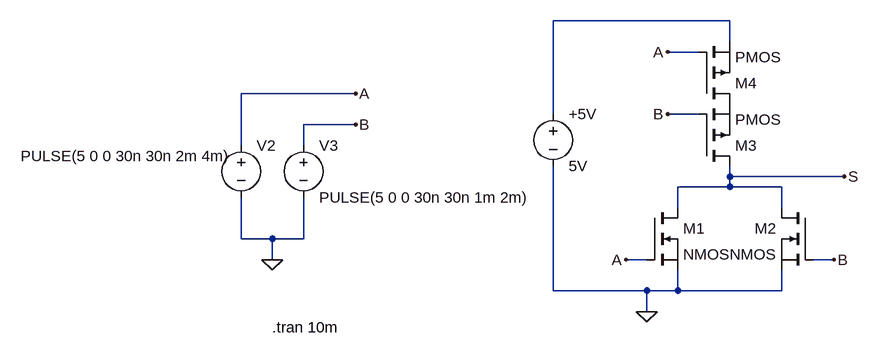
[diagram p0: schematic NOR.asc]
NOR.asc, the LTspice schematic file:
Version 4
SHEET 1 880 680
WIRE 352 48 80 48
WIRE 352 80 352 48
WIRE 304 96 256 96
WIRE -224 160 -400 160
WIRE 80 192 80 48
WIRE 304 192 256 192
WIRE -224 208 -304 208
WIRE -400 240 -400 160
WIRE -304 240 -304 208
WIRE 352 288 352 272
WIRE 528 288 352 288
WIRE 352 304 352 288
WIRE 352 304 272 304
WIRE 432 304 352 304
WIRE 272 336 272 304
WIRE 432 336 432 304
WIRE -400 384 -400 320
WIRE -352 384 -400 384
WIRE -304 384 -304 320
WIRE -304 384 -352 384
WIRE -352 416 -352 384
WIRE 224 416 192 416
WIRE 512 416 480 416
WIRE 80 464 80 272
WIRE 224 464 80 464
WIRE 272 464 272 432
WIRE 272 464 224 464
WIRE 432 464 432 432
WIRE 432 464 272 464
WIRE 224 496 224 464
FLAG -352 416 0
FLAG -224 160 A
FLAG -224 208 B
FLAG 256 96 A
FLAG 256 192 B
FLAG 224 496 0
FLAG 192 416 A
FLAG 512 416 B
FLAG 528 288 S
SYMBOL voltage 80 176 R0
WINDOW 123 0 0 Left 0
WINDOW 39 0 0 Left 0
SYMATTR InstName +5V
SYMATTR Value 5V
SYMBOL voltage -400 224 R0
WINDOW 3 -339 32 Left 2
WINDOW 123 0 0 Left 0
WINDOW 39 0 0 Left 0
SYMATTR Value PULSE(5 0 0 30n 30n 2m 4m)
SYMATTR InstName V2
SYMBOL voltage -304 224 R0
WINDOW 123 0 0 Left 0
WINDOW 39 0 0 Left 0
SYMATTR InstName V3
SYMATTR Value PULSE(5 0 0 30n 30n 1m 2m)
SYMBOL nmos 224 336 R0
SYMATTR InstName M1
SYMBOL nmos 480 336 M0
SYMATTR InstName M2
SYMBOL pmos 304 176 M180
SYMATTR InstName M4
SYMBOL pmos 304 272 M180
SYMATTR InstName M3
TEXT -352 520 Left 2 !.tran 10m

The netlist it stands for:
* NOR.asc
V§+5V N001 0 5V
V2 A 0 PULSE(5 0 0 30n 30n 2m 4m)
V3 B 0 PULSE(5 0 0 30n 30n 1m 2m)
M1 S A 0 0 NMOS
M2 S B 0 0 NMOS
M4 P001 A N001 N001 PMOS
M3 S B P001 P001 PMOS
.model NMOS NMOS
.model PMOS PMOS
.lib standard.mos
.tran 10m
.backanno
.end

* Results of the author's LTspice run, read from the files saved beside the schematic
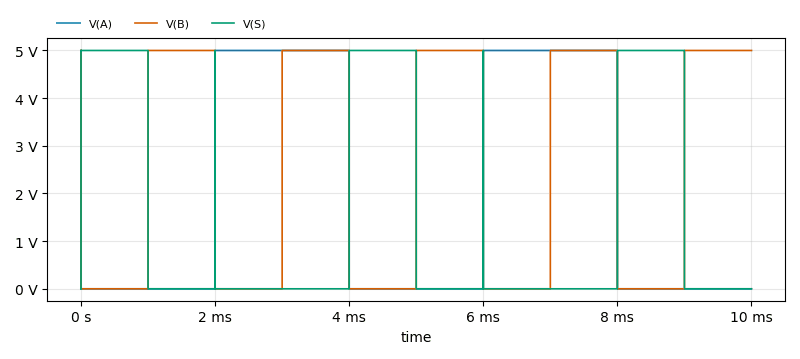
[diagram p1: Transient Analysis of NOR.asc, plotted from the saved traces]
* Transient Analysis, 1 run:
*   V(A): min 0 V, max 5 V, average 2 V, rms 3.162 V, last 0 V
*   V(B): min 0 V, max 5 V, average 2.5 V, rms 3.535 V, last 5 V
*   V(S): min 0 V, max 5.002 V, average 1.5 V, rms 2.739 V, last 0 V